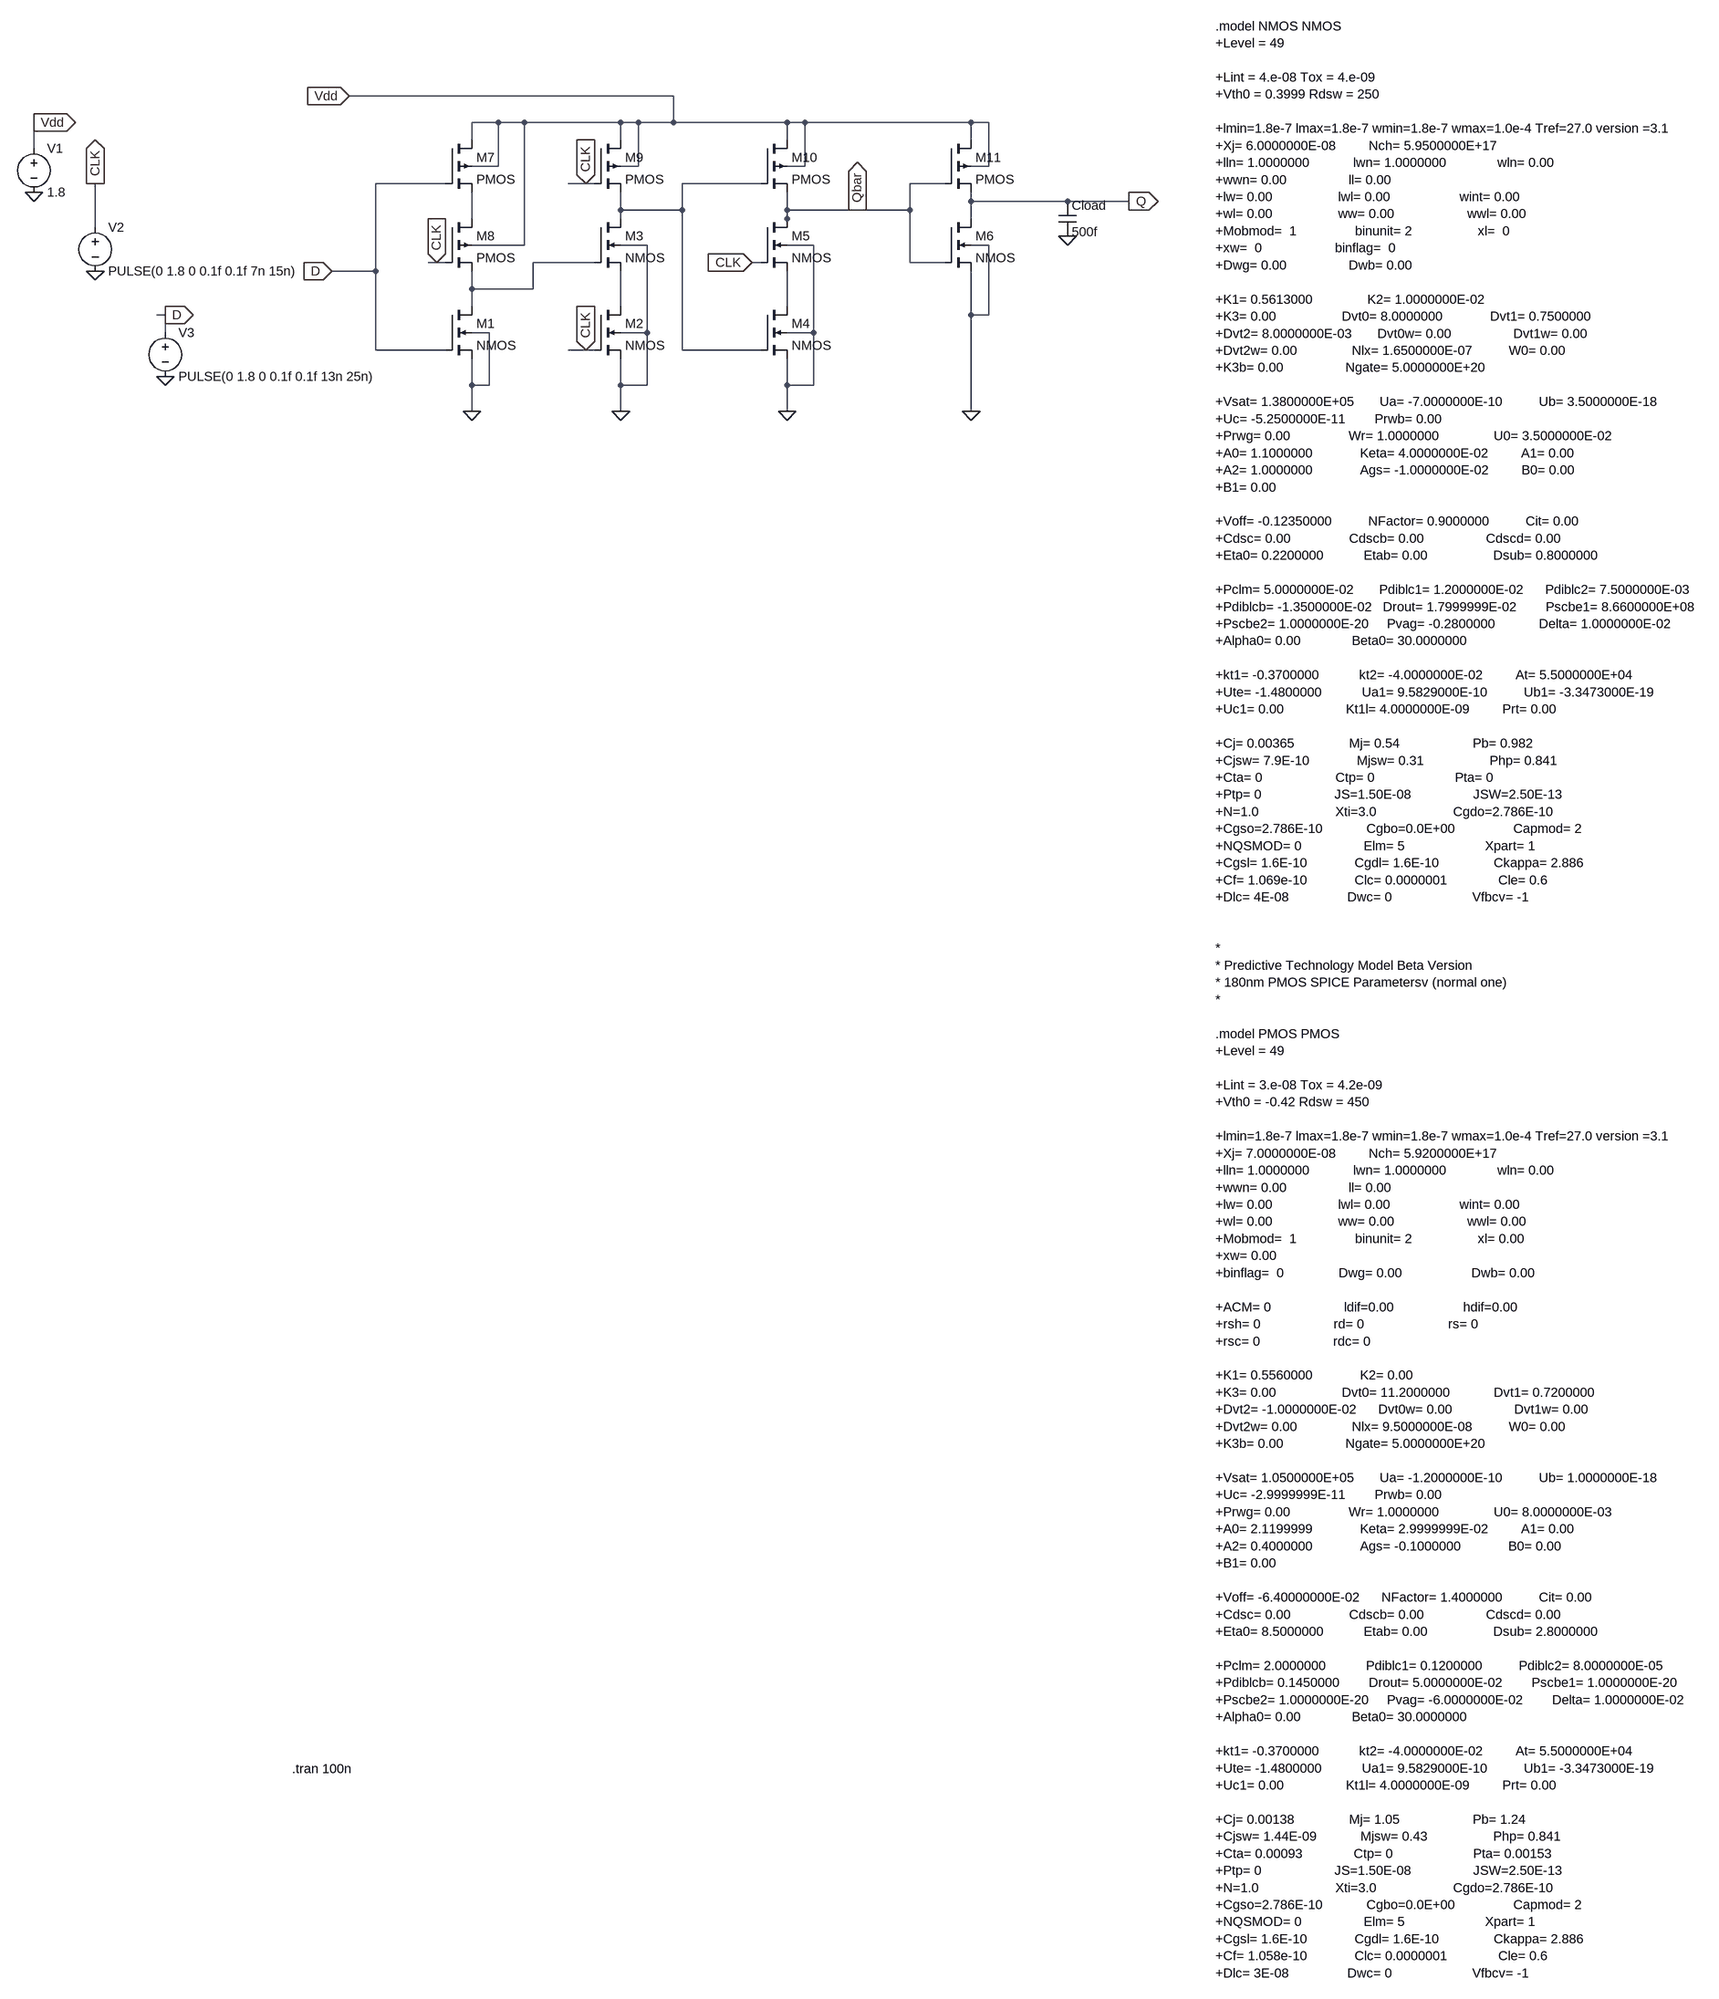
[diagram p0: schematic tspcfinal.asc]
tspcfinal.asc, the LTspice schematic file:
Version 4
SHEET 1 2488 3056
WIRE 416 -16 -176 -16
WIRE -752 32 -752 16
WIRE 96 32 48 32
WIRE 144 32 96 32
WIRE 320 32 144 32
WIRE 352 32 320 32
WIRE 416 32 416 -16
WIRE 416 32 352 32
WIRE 624 32 416 32
WIRE 656 32 624 32
WIRE 960 32 656 32
WIRE 992 32 960 32
WIRE 48 64 48 32
WIRE 320 64 320 32
WIRE 624 64 624 32
WIRE 960 64 960 32
WIRE -752 80 -752 32
WIRE 96 112 96 32
WIRE 96 112 48 112
WIRE 352 112 352 32
WIRE 352 112 320 112
WIRE 656 112 656 32
WIRE 656 112 624 112
WIRE 992 112 992 32
WIRE 992 112 960 112
WIRE 0 144 -128 144
WIRE 256 144 224 144
WIRE 272 144 256 144
WIRE 576 144 432 144
WIRE 912 144 848 144
WIRE 960 176 960 160
WIRE 1136 176 960 176
WIRE 1248 176 1136 176
WIRE 320 192 320 160
WIRE 432 192 432 144
WIRE 432 192 320 192
WIRE 624 192 624 160
WIRE 752 192 624 192
WIRE 848 192 848 144
WIRE 848 192 752 192
WIRE 48 208 48 160
WIRE 320 208 320 192
WIRE 624 208 624 192
WIRE 960 208 960 176
WIRE -640 224 -640 144
WIRE 624 224 624 208
WIRE 144 256 144 32
WIRE 144 256 48 256
WIRE 368 256 320 256
WIRE 672 256 624 256
WIRE 992 256 960 256
WIRE -16 288 -32 288
WIRE 0 288 -16 288
WIRE 272 288 160 288
WIRE 576 288 560 288
WIRE 848 288 848 192
WIRE 912 288 848 288
WIRE -128 304 -128 144
WIRE -128 304 -208 304
WIRE 48 336 48 304
WIRE 160 336 160 288
WIRE 160 336 48 336
WIRE 48 368 48 336
WIRE 320 368 320 304
WIRE 624 368 624 304
WIRE -512 384 -528 384
WIRE 960 384 960 304
WIRE 992 384 992 256
WIRE 992 384 960 384
WIRE -512 416 -512 384
WIRE 80 416 48 416
WIRE 368 416 368 256
WIRE 368 416 320 416
WIRE 672 416 672 256
WIRE 672 416 624 416
WIRE -128 448 -128 304
WIRE 0 448 -128 448
WIRE 256 448 224 448
WIRE 272 448 256 448
WIRE 432 448 432 192
WIRE 576 448 432 448
WIRE 48 512 48 464
WIRE 80 512 80 416
WIRE 80 512 48 512
WIRE 320 512 320 464
WIRE 368 512 368 416
WIRE 368 512 320 512
WIRE 624 512 624 464
WIRE 672 512 672 416
WIRE 672 512 624 512
WIRE 48 560 48 512
WIRE 320 560 320 512
WIRE 624 560 624 512
WIRE 960 560 960 384
FLAG 48 560 0
FLAG 320 560 0
FLAG 624 560 0
FLAG 960 560 0
FLAG -208 304 D
IOPIN -208 304 In
FLAG -16 288 CLK
IOPIN -16 288 In
FLAG 256 144 CLK
IOPIN 256 144 In
FLAG 256 448 CLK
IOPIN 256 448 In
FLAG 560 288 CLK
IOPIN 560 288 In
FLAG -176 -16 Vdd
IOPIN -176 -16 In
FLAG 752 192 Qbar
IOPIN 752 192 Out
FLAG 1248 176 Q
IOPIN 1248 176 Out
FLAG -752 160 0
FLAG -640 304 0
FLAG -512 496 0
FLAG -752 32 Vdd
IOPIN -752 32 Out
FLAG -640 144 CLK
IOPIN -640 144 Out
FLAG -512 384 D
IOPIN -512 384 Out
FLAG 1136 240 0
SYMBOL nmos4 0 368 R0
SYMATTR InstName M1
SYMATTR Value2 l=180n w=3.95u
SYMBOL nmos4 272 368 R0
SYMATTR InstName M2
SYMATTR Value2 l=180n w=15.8u
SYMBOL nmos4 272 208 R0
SYMATTR InstName M3
SYMATTR Value2 l=180n w=15.8u
SYMBOL nmos4 576 368 R0
SYMATTR InstName M4
SYMATTR Value2 l=180n w=7.95u
SYMBOL nmos4 576 208 R0
SYMATTR InstName M5
SYMATTR Value2 l=180n w=7.95u
SYMBOL nmos4 912 208 R0
SYMATTR InstName M6
SYMATTR Value2 l=180n w=31.4u
SYMBOL pmos4 0 64 R0
SYMATTR InstName M7
SYMATTR Value2 l=180n w=15.7u
SYMBOL pmos4 0 208 R0
SYMATTR InstName M8
SYMATTR Value2 l=180n w=15.7u
SYMBOL pmos4 272 64 R0
SYMATTR InstName M9
SYMATTR Value2 l=180n w=31.5u
SYMBOL pmos4 576 64 R0
SYMATTR InstName M10
SYMATTR Value2 l=180n w=63.1u
SYMBOL pmos4 912 64 R0
SYMATTR InstName M11
SYMATTR Value2 l=180n w=126.3u
SYMBOL cap 1120 176 R0
SYMATTR InstName Cload
SYMATTR Value 500f
SYMBOL voltage -752 64 R0
WINDOW 123 0 0 Left 0
WINDOW 39 0 0 Left 0
SYMATTR InstName V1
SYMATTR Value 1.8
SYMBOL voltage -640 208 R0
WINDOW 123 0 0 Left 0
WINDOW 39 0 0 Left 0
SYMATTR InstName V2
SYMATTR Value PULSE(0 1.8 0 0.1f 0.1f 7n 15n)
SYMBOL voltage -512 400 R0
WINDOW 123 0 0 Left 0
WINDOW 39 0 0 Left 0
SYMATTR InstName V3
SYMATTR Value PULSE(0 1.8 0 0.1f 0.1f 13n 25n)
TEXT 1520 -144 Left 2 !.model NMOS NMOS\n+Level = 49\n \n+Lint = 4.e-08 Tox = 4.e-09 \n+Vth0 = 0.3999 Rdsw = 250 \n \n+lmin=1.8e-7 lmax=1.8e-7 wmin=1.8e-7 wmax=1.0e-4 Tref=27.0 version =3.1\n+Xj= 6.0000000E-08         Nch= 5.9500000E+17 \n+lln= 1.0000000            lwn= 1.0000000              wln= 0.00\n+wwn= 0.00                 ll= 0.00\n+lw= 0.00                  lwl= 0.00                   wint= 0.00\n+wl= 0.00                  ww= 0.00                    wwl= 0.00\n+Mobmod=  1                binunit= 2                  xl=  0\n+xw=  0                    binflag=  0\n+Dwg= 0.00                 Dwb= 0.00 \n \n+K1= 0.5613000               K2= 1.0000000E-02 \n+K3= 0.00                  Dvt0= 8.0000000             Dvt1= 0.7500000 \n+Dvt2= 8.0000000E-03       Dvt0w= 0.00                 Dvt1w= 0.00 \n+Dvt2w= 0.00               Nlx= 1.6500000E-07          W0= 0.00 \n+K3b= 0.00                 Ngate= 5.0000000E+20 \n \n+Vsat= 1.3800000E+05       Ua= -7.0000000E-10          Ub= 3.5000000E-18 \n+Uc= -5.2500000E-11        Prwb= 0.00 \n+Prwg= 0.00                Wr= 1.0000000               U0= 3.5000000E-02 \n+A0= 1.1000000             Keta= 4.0000000E-02         A1= 0.00 \n+A2= 1.0000000             Ags= -1.0000000E-02         B0= 0.00 \n+B1= 0.00 \n \n+Voff= -0.12350000          NFactor= 0.9000000          Cit= 0.00 \n+Cdsc= 0.00                Cdscb= 0.00                 Cdscd= 0.00 \n+Eta0= 0.2200000           Etab= 0.00                  Dsub= 0.8000000 \n \n+Pclm= 5.0000000E-02       Pdiblc1= 1.2000000E-02      Pdiblc2= 7.5000000E-03 \n+Pdiblcb= -1.3500000E-02   Drout= 1.7999999E-02        Pscbe1= 8.6600000E+08 \n+Pscbe2= 1.0000000E-20     Pvag= -0.2800000            Delta= 1.0000000E-02 \n+Alpha0= 0.00              Beta0= 30.0000000 \n \n+kt1= -0.3700000           kt2= -4.0000000E-02         At= 5.5000000E+04 \n+Ute= -1.4800000           Ua1= 9.5829000E-10          Ub1= -3.3473000E-19 \n+Uc1= 0.00                 Kt1l= 4.0000000E-09         Prt= 0.00 \n \n+Cj= 0.00365               Mj= 0.54                    Pb= 0.982\n+Cjsw= 7.9E-10             Mjsw= 0.31                  Php= 0.841\n+Cta= 0                    Ctp= 0                      Pta= 0\n+Ptp= 0                    JS=1.50E-08                 JSW=2.50E-13\n+N=1.0                     Xti=3.0                     Cgdo=2.786E-10\n+Cgso=2.786E-10            Cgbo=0.0E+00                Capmod= 2\n+NQSMOD= 0                 Elm= 5                      Xpart= 1\n+Cgsl= 1.6E-10             Cgdl= 1.6E-10               Ckappa= 2.886\n+Cf= 1.069e-10             Clc= 0.0000001              Cle= 0.6\n+Dlc= 4E-08                Dwc= 0                      Vfbcv= -1\n \n\n*\n* Predictive Technology Model Beta Version\n* 180nm PMOS SPICE Parametersv (normal one)\n*\n \n.model PMOS PMOS\n+Level = 49\n \n+Lint = 3.e-08 Tox = 4.2e-09 \n+Vth0 = -0.42 Rdsw = 450 \n \n+lmin=1.8e-7 lmax=1.8e-7 wmin=1.8e-7 wmax=1.0e-4 Tref=27.0 version =3.1\n+Xj= 7.0000000E-08         Nch= 5.9200000E+17 \n+lln= 1.0000000            lwn= 1.0000000              wln= 0.00\n+wwn= 0.00                 ll= 0.00\n+lw= 0.00                  lwl= 0.00                   wint= 0.00\n+wl= 0.00                  ww= 0.00                    wwl= 0.00\n+Mobmod=  1                binunit= 2                  xl= 0.00\n+xw= 0.00                  \n+binflag=  0               Dwg= 0.00                   Dwb= 0.00 \n \n+ACM= 0                    ldif=0.00                   hdif=0.00\n+rsh= 0                    rd= 0                       rs= 0\n+rsc= 0                    rdc= 0\n \n+K1= 0.5560000             K2= 0.00 \n+K3= 0.00                  Dvt0= 11.2000000            Dvt1= 0.7200000 \n+Dvt2= -1.0000000E-02      Dvt0w= 0.00                 Dvt1w= 0.00 \n+Dvt2w= 0.00               Nlx= 9.5000000E-08          W0= 0.00 \n+K3b= 0.00                 Ngate= 5.0000000E+20 \n \n+Vsat= 1.0500000E+05       Ua= -1.2000000E-10          Ub= 1.0000000E-18 \n+Uc= -2.9999999E-11        Prwb= 0.00 \n+Prwg= 0.00                Wr= 1.0000000               U0= 8.0000000E-03 \n+A0= 2.1199999             Keta= 2.9999999E-02         A1= 0.00 \n+A2= 0.4000000             Ags= -0.1000000             B0= 0.00 \n+B1= 0.00 \n \n+Voff= -6.40000000E-02      NFactor= 1.4000000          Cit= 0.00 \n+Cdsc= 0.00                Cdscb= 0.00                 Cdscd= 0.00 \n+Eta0= 8.5000000           Etab= 0.00                  Dsub= 2.8000000 \n \n+Pclm= 2.0000000           Pdiblc1= 0.1200000          Pdiblc2= 8.0000000E-05 \n+Pdiblcb= 0.1450000        Drout= 5.0000000E-02        Pscbe1= 1.0000000E-20 \n+Pscbe2= 1.0000000E-20     Pvag= -6.0000000E-02        Delta= 1.0000000E-02 \n+Alpha0= 0.00              Beta0= 30.0000000 \n \n+kt1= -0.3700000           kt2= -4.0000000E-02         At= 5.5000000E+04 \n+Ute= -1.4800000           Ua1= 9.5829000E-10          Ub1= -3.3473000E-19 \n+Uc1= 0.00                 Kt1l= 4.0000000E-09         Prt= 0.00 \n \n+Cj= 0.00138               Mj= 1.05                    Pb= 1.24\n+Cjsw= 1.44E-09            Mjsw= 0.43                  Php= 0.841\n+Cta= 0.00093              Ctp= 0                      Pta= 0.00153\n+Ptp= 0                    JS=1.50E-08                 JSW=2.50E-13\n+N=1.0                     Xti=3.0                     Cgdo=2.786E-10\n+Cgso=2.786E-10            Cgbo=0.0E+00                Capmod= 2\n+NQSMOD= 0                 Elm= 5                      Xpart= 1\n+Cgsl= 1.6E-10             Cgdl= 1.6E-10               Ckappa= 2.886\n+Cf= 1.058e-10             Clc= 0.0000001              Cle= 0.6\n+Dlc= 3E-08                Dwc= 0                      Vfbcv= -1
TEXT -280 3040 Left 2 !.tran 100n

The netlist it stands for:
* tspcfinal.asc
M1 N003 D 0 0 NMOS l=180n w=3.95u
M2 N004 CLK 0 0 NMOS l=180n w=15.8u
M3 N001 N003 N004 0 NMOS l=180n w=15.8u
M4 N005 N001 0 0 NMOS l=180n w=7.95u
M5 Qbar CLK N005 0 NMOS l=180n w=7.95u
M6 Q Qbar 0 0 NMOS l=180n w=31.4u
M7 Vdd D N002 Vdd PMOS l=180n w=15.7u
M8 N002 CLK N003 Vdd PMOS l=180n w=15.7u
M9 Vdd CLK N001 Vdd PMOS l=180n w=31.5u
M10 Vdd N001 Qbar Vdd PMOS l=180n w=63.1u
M11 Vdd Qbar Q Vdd PMOS l=180n w=126.3u
Cload Q 0 500f
V1 Vdd 0 1.8
V2 CLK 0 PULSE(0 1.8 0 0.1f 0.1f 7n 15n)
V3 D 0 PULSE(0 1.8 0 0.1f 0.1f 13n 25n)
.model NMOS NMOS
.model PMOS PMOS
.lib standard.mos
.model NMOS NMOS
+Level = 49
+Lint = 4.e-08 Tox = 4.e-09
+Vth0 = 0.3999 Rdsw = 250
+lmin=1.8e-7 lmax=1.8e-7 wmin=1.8e-7 wmax=1.0e-4 Tref=27.0 version =3.1
+Xj= 6.0000000E-08         Nch= 5.9500000E+17
+lln= 1.0000000            lwn= 1.0000000              wln= 0.00
+wwn= 0.00                 ll= 0.00
+lw= 0.00                  lwl= 0.00                   wint= 0.00
+wl= 0.00                  ww= 0.00                    wwl= 0.00
+Mobmod=  1                binunit= 2                  xl=  0
+xw=  0                    binflag=  0
+Dwg= 0.00                 Dwb= 0.00
+K1= 0.5613000               K2= 1.0000000E-02
+K3= 0.00                  Dvt0= 8.0000000             Dvt1= 0.7500000
+Dvt2= 8.0000000E-03       Dvt0w= 0.00                 Dvt1w= 0.00
+Dvt2w= 0.00               Nlx= 1.6500000E-07          W0= 0.00
+K3b= 0.00                 Ngate= 5.0000000E+20
+Vsat= 1.3800000E+05       Ua= -7.0000000E-10          Ub= 3.5000000E-18
+Uc= -5.2500000E-11        Prwb= 0.00
+Prwg= 0.00                Wr= 1.0000000               U0= 3.5000000E-02
+A0= 1.1000000             Keta= 4.0000000E-02         A1= 0.00
+A2= 1.0000000             Ags= -1.0000000E-02         B0= 0.00
+B1= 0.00
+Voff= -0.12350000          NFactor= 0.9000000          Cit= 0.00
+Cdsc= 0.00                Cdscb= 0.00                 Cdscd= 0.00
+Eta0= 0.2200000           Etab= 0.00                  Dsub= 0.8000000
+Pclm= 5.0000000E-02       Pdiblc1= 1.2000000E-02      Pdiblc2= 7.5000000E-03
+Pdiblcb= -1.3500000E-02   Drout= 1.7999999E-02        Pscbe1= 8.6600000E+08
+Pscbe2= 1.0000000E-20     Pvag= -0.2800000            Delta= 1.0000000E-02
+Alpha0= 0.00              Beta0= 30.0000000
+kt1= -0.3700000           kt2= -4.0000000E-02         At= 5.5000000E+04
+Ute= -1.4800000           Ua1= 9.5829000E-10          Ub1= -3.3473000E-19
+Uc1= 0.00                 Kt1l= 4.0000000E-09         Prt= 0.00
+Cj= 0.00365               Mj= 0.54                    Pb= 0.982
+Cjsw= 7.9E-10             Mjsw= 0.31                  Php= 0.841
+Cta= 0                    Ctp= 0                      Pta= 0
+Ptp= 0                    JS=1.50E-08                 JSW=2.50E-13
+N=1.0                     Xti=3.0                     Cgdo=2.786E-10
+Cgso=2.786E-10            Cgbo=0.0E+00                Capmod= 2
+NQSMOD= 0                 Elm= 5                      Xpart= 1
+Cgsl= 1.6E-10             Cgdl= 1.6E-10               Ckappa= 2.886
+Cf= 1.069e-10             Clc= 0.0000001              Cle= 0.6
+Dlc= 4E-08                Dwc= 0                      Vfbcv= -1
*
* Predictive Technology Model Beta Version
* 180nm PMOS SPICE Parametersv (normal one)
*
.model PMOS PMOS
+Level = 49
+Lint = 3.e-08 Tox = 4.2e-09
+Vth0 = -0.42 Rdsw = 450
+lmin=1.8e-7 lmax=1.8e-7 wmin=1.8e-7 wmax=1.0e-4 Tref=27.0 version =3.1
+Xj= 7.0000000E-08         Nch= 5.9200000E+17
+lln= 1.0000000            lwn= 1.0000000              wln= 0.00
+wwn= 0.00                 ll= 0.00
+lw= 0.00                  lwl= 0.00                   wint= 0.00
+wl= 0.00                  ww= 0.00                    wwl= 0.00
+Mobmod=  1                binunit= 2                  xl= 0.00
+xw= 0.00
+binflag=  0               Dwg= 0.00                   Dwb= 0.00
+ACM= 0                    ldif=0.00                   hdif=0.00
+rsh= 0                    rd= 0                       rs= 0
+rsc= 0                    rdc= 0
+K1= 0.5560000             K2= 0.00
+K3= 0.00                  Dvt0= 11.2000000            Dvt1= 0.7200000
+Dvt2= -1.0000000E-02      Dvt0w= 0.00                 Dvt1w= 0.00
+Dvt2w= 0.00               Nlx= 9.5000000E-08          W0= 0.00
+K3b= 0.00                 Ngate= 5.0000000E+20
+Vsat= 1.0500000E+05       Ua= -1.2000000E-10          Ub= 1.0000000E-18
+Uc= -2.9999999E-11        Prwb= 0.00
+Prwg= 0.00                Wr= 1.0000000               U0= 8.0000000E-03
+A0= 2.1199999             Keta= 2.9999999E-02         A1= 0.00
+A2= 0.4000000             Ags= -0.1000000             B0= 0.00
+B1= 0.00
+Voff= -6.40000000E-02      NFactor= 1.4000000          Cit= 0.00
+Cdsc= 0.00                Cdscb= 0.00                 Cdscd= 0.00
+Eta0= 8.5000000           Etab= 0.00                  Dsub= 2.8000000
+Pclm= 2.0000000           Pdiblc1= 0.1200000          Pdiblc2= 8.0000000E-05
+Pdiblcb= 0.1450000        Drout= 5.0000000E-02        Pscbe1= 1.0000000E-20
+Pscbe2= 1.0000000E-20     Pvag= -6.0000000E-02        Delta= 1.0000000E-02
+Alpha0= 0.00              Beta0= 30.0000000
+kt1= -0.3700000           kt2= -4.0000000E-02         At= 5.5000000E+04
+Ute= -1.4800000           Ua1= 9.5829000E-10          Ub1= -3.3473000E-19
+Uc1= 0.00                 Kt1l= 4.0000000E-09         Prt= 0.00
+Cj= 0.00138               Mj= 1.05                    Pb= 1.24
+Cjsw= 1.44E-09            Mjsw= 0.43                  Php= 0.841
+Cta= 0.00093              Ctp= 0                      Pta= 0.00153
+Ptp= 0                    JS=1.50E-08                 JSW=2.50E-13
+N=1.0                     Xti=3.0                     Cgdo=2.786E-10
+Cgso=2.786E-10            Cgbo=0.0E+00                Capmod= 2
+NQSMOD= 0                 Elm= 5                      Xpart= 1
+Cgsl= 1.6E-10             Cgdl= 1.6E-10               Ckappa= 2.886
+Cf= 1.058e-10             Clc= 0.0000001              Cle= 0.6
+Dlc= 3E-08                Dwc= 0                      Vfbcv= -1
.tran 100n
.backanno
.end